# EAGLE design shield-rs422 (EAGLE 7.5.0)
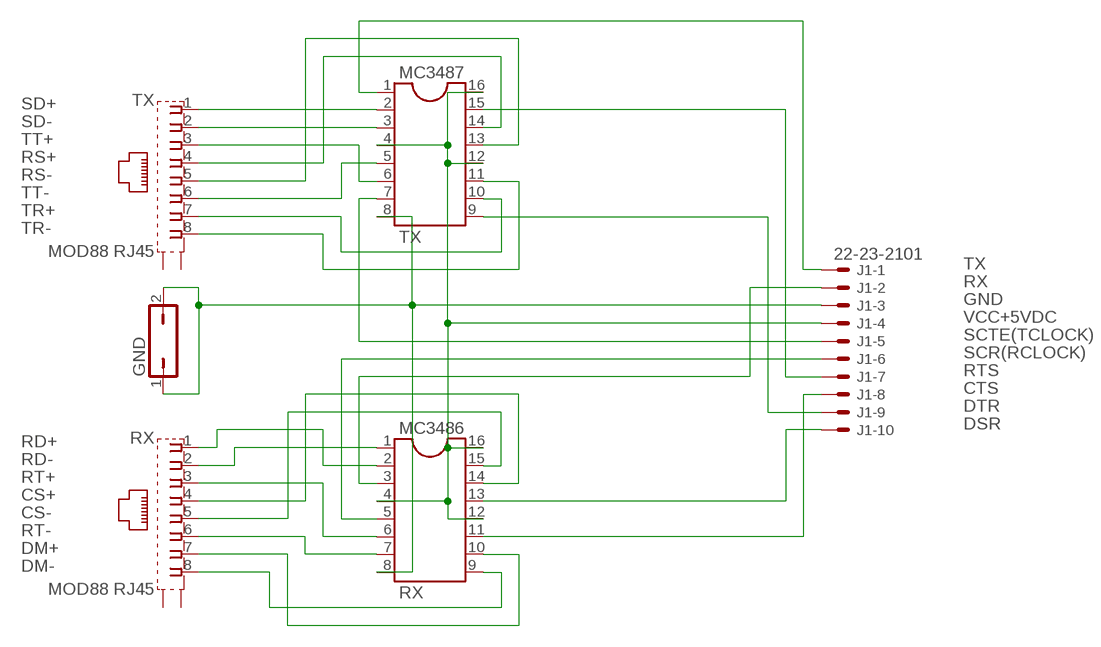
[diagram p0: schematic, sheet 1]

## Parts
GND  JP1Q  [JP1]
J1  22-23-2101  [22-23-2101]
MC3486  RX  DIL16  [DIL16]
MC3487  TX  DIL16  [DIL16]
RX  MOD88 RJ45  GLX-S-88M  [GLX-S-88M]
TX  MOD88 RJ45  GLX-S-88M  [GLX-S-88M]

## Nets
CS+: MC3486.14 RX.4
CS-: MC3486.15 RX.5
CTS: J1.8 MC3486.11
DM+: MC3486.10 RX.7
DM-: MC3486.9 RX.8
DSR: J1.10 MC3486.13
DTR: J1.9 MC3487.9
GND: GND.1 GND.2 J1.3 MC3486.8 MC3487.8
RD+: MC3486.2 RX.1
RD-: MC3486.1 RX.2
RS+: MC3487.14 TX.4
RS-: MC3487.13 TX.5
RT+: MC3486.6 RX.3
RT-: MC3486.7 RX.6
RTS: J1.7 MC3487.15
RX: J1.2 MC3486.3
SCR(RCLOCK): J1.6 MC3486.5
SCTE(TCLOCK): J1.5 MC3487.7
SD+: MC3487.2 TX.1
SD-: MC3487.3 TX.2
TR+: MC3487.10 TX.7
TR-: MC3487.11 TX.8
TT+: MC3487.6 TX.3
TT-: MC3487.5 TX.6
TX: J1.1 MC3487.1
VCC+5VDC: J1.4 MC3486.4 MC3486.12 MC3486.16 MC3487.4 MC3487.12 MC3487.16
Unconnected: RX.S1 RX.S2 TX.S1 TX.S2

## Library data of the parts
GND = jumper:JP1Q: JUMPER
J1 = con-molex:22-23-2101: .100" (2.54mm) Center Header - 10 Pin; MF: MOLEX; MPN: 22-23-2101; OC_FARNELL: 1756828; OC_NEWARK: 94C0765
MC3486 MC3487 = ic-package:DIL16: Dual In Line / Socket
RX TX = con-kycon:GLX-S-88M: Mod. Jack, Right Angle, 8 posiotion, 8 contatcs RJ45 Source: GLX-S-88M.pdf; OC_FARNELL: unknown; OC_NEWARK: unknown

## Board
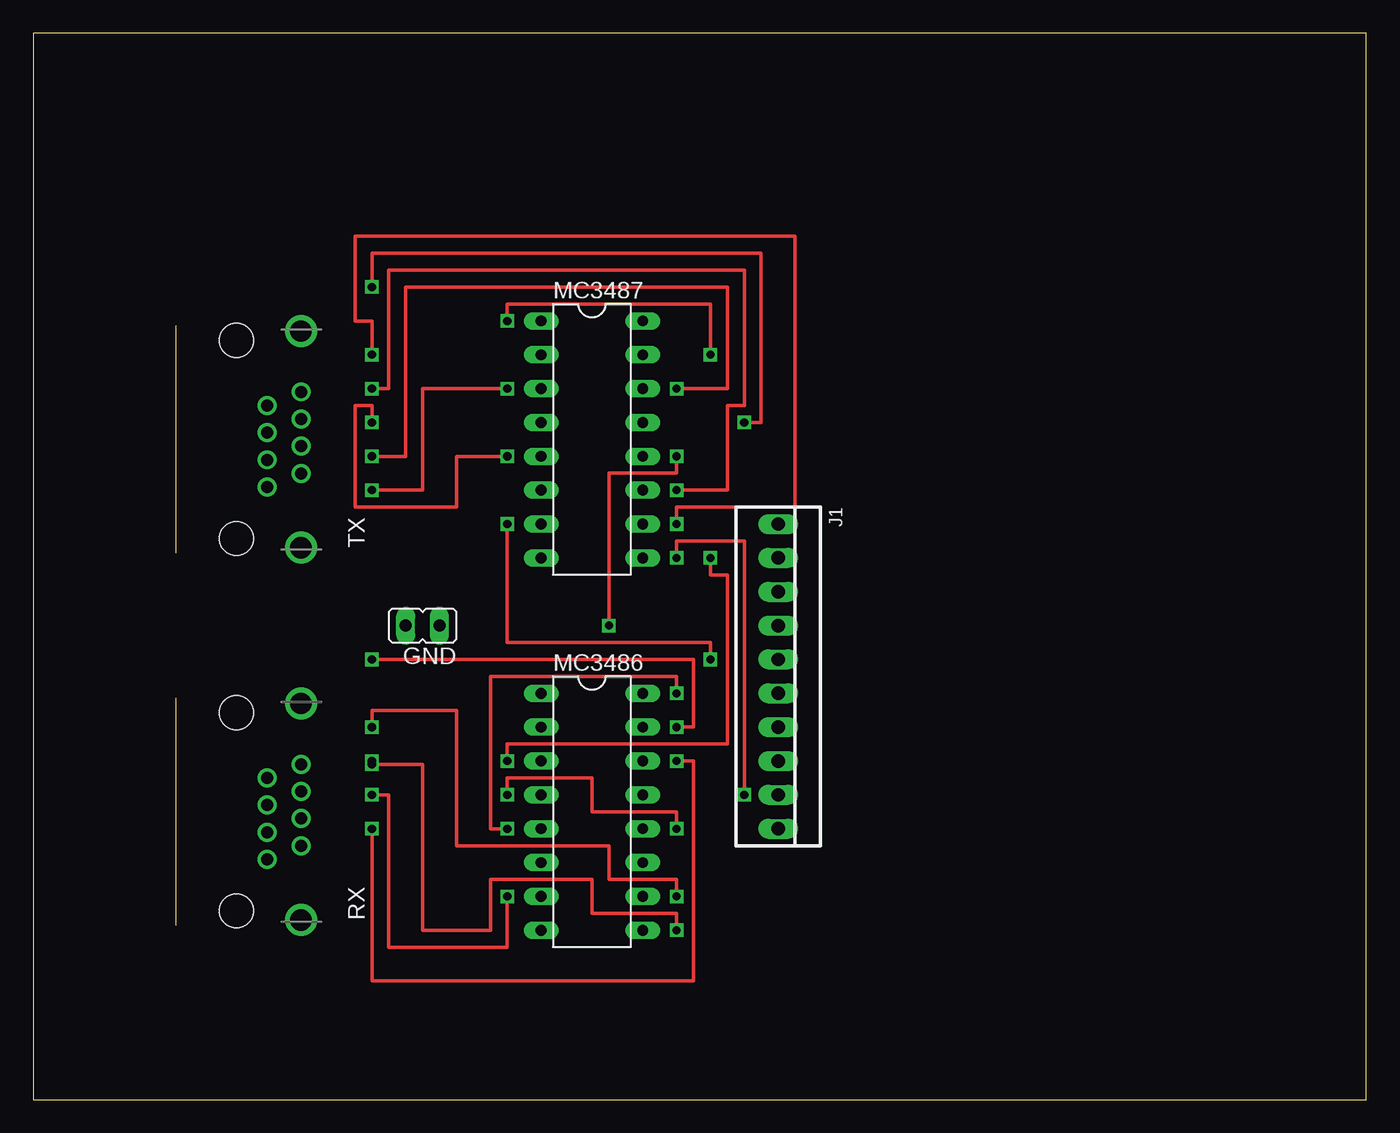
[diagram p1: board, top side]
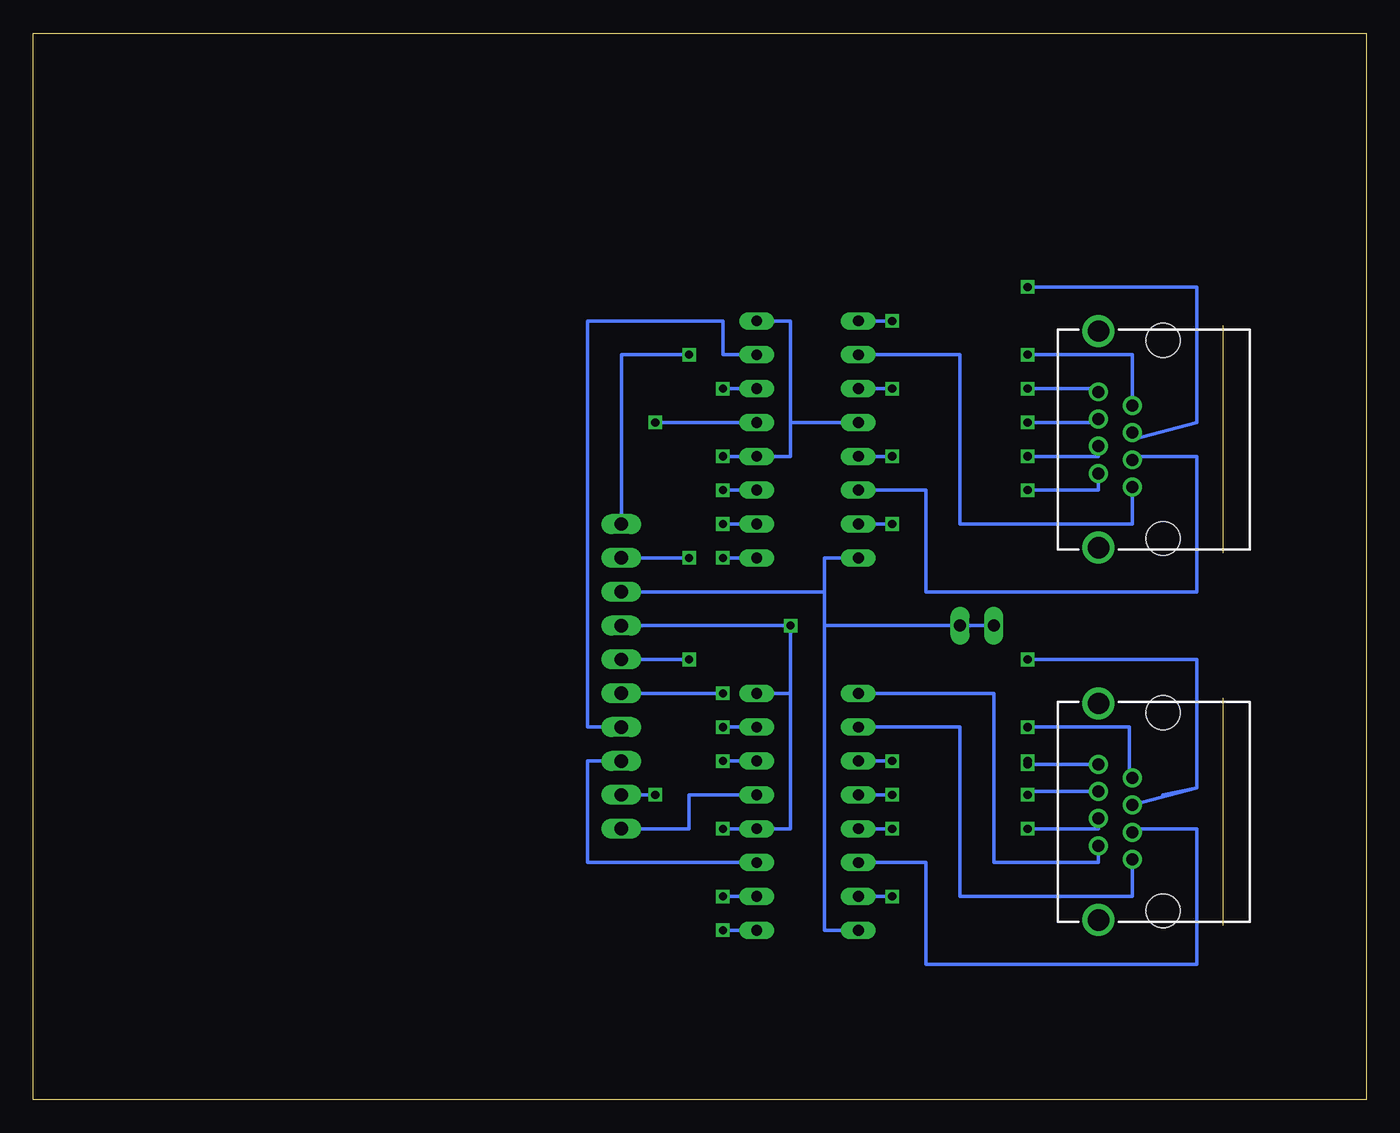
[diagram p2: board, bottom side, seen from below]

Size 100 x 80 mm. Coordinates in mm from the lower left corner, seen from the top.
Outline: 0,0 100,0 100,80 0,80 0,0
Copper layers (1*16): Top 0.035mm / dielectric 1.5mm / Bottom 0.035mm
Design rules "default": minimum track width 10mil, minimum drill 24mil, track to track 8mil, track to pad 8mil, pad to pad 8mil, via to via 8mil, smd to smd 8mil, copper to edge 40mil, drill to drill 8mil, minimum pad ring 10mil, minimum via ring 8mil, stop-mask expansion 4mil, vias tented up to drill 0mil, thermal gap 10mil

### Footprints (pad centres in the part's own frame; a part is rotated, then mirrored left to right if it is on the bottom)
JP1 = drill 0.914 long: 1 0,-1.27; 2 0,1.27
22-23-2101 = drill 1 long: 1 -11.43,0; 2 -8.89,0; 3 -6.35,0; 4 -3.81,0; 5 -1.27,0; 6 1.27,0; 7 3.81,0; 8 6.35,0; 9 8.89,0; 10 11.43,0
DIL16 = drill 0.813 long: 1 -8.89,-3.81; 2 -6.35,-3.81; 3 -3.81,-3.81; 4 -1.27,-3.81; 5 1.27,-3.81; 6 3.81,-3.81; 7 6.35,-3.81; 8 8.89,-3.81; 9 8.89,3.81; 10 6.35,3.81; 11 3.81,3.81; 12 1.27,3.81; 13 -1.27,3.81; 14 -3.81,3.81; 15 -6.35,3.81; 16 -8.89,3.81
GLX-S-88M = drill 0.9 pad 1.422: 1 -3.57,-2.3; 2 -2.55,-4.84; 3 -1.53,-2.3; 4 -0.51,-4.84; 5 0.51,-2.3; 6 1.53,-4.84; 7 2.55,-2.3; 8 3.57,-4.84 | drill 1.6 pad 2.184: S1 -8.125,-4.84; S2 8.125,-4.84 | hole 2.55: -7.44,0; 7.44,0

### Placement (x,y rotation side)
GND  29.21,35.56 90 top
J1  55.88,31.75 270 top
MC3486  41.91,21.59 270 top
MC3487  41.91,49.53 270 top
RX  15.24,21.59 90 top
TX  15.24,49.53 90 top

### Tracks (layer width: path | path; a pad name or v marks a point on that pad's centre or on a via)
CS+  (via drill 0.61)
  Top 0.254: v25.4,20.32 25.4,8.89 49.53,8.89 49.53,25.4 v48.26,25.4
  Bottom 0.254: MC3486.14 v48.26,25.4 | RX.4 20.08,20.32 v25.4,20.32
CS-  (via drill 0.61)
  Top 0.254: v48.26,27.94 49.53,27.94 49.53,33.02 v25.4,33.02
  Bottom 0.254: MC3486.15 v48.26,27.94 | RX.5 12.7,23.37 | 12.7,23.37 15.24,22.86 | v25.4,33.02 12.7,33.02 12.7,23.37
CTS
  Bottom 0.254: MC3486.11 58.42,17.78 58.42,25.4 J1.8
DM+  (via drill 0.61)
  Top 0.254: v48.26,15.24 48.26,16.51 43.18,16.51 43.18,19.05 31.75,19.05 31.75,29.21 25.4,29.21 v25.4,27.94
  Bottom 0.254: RX.7 17.78,24.14 17.78,27.94 v25.4,27.94 | MC3486.10 v48.26,15.24
DM-  (via drill 0.61)
  Top 0.254: v25.4,25.16 29.21,25.16 29.21,12.7 34.29,12.7 34.29,16.51 41.91,16.51 41.91,13.97 48.26,13.97 v48.26,12.7
  Bottom 0.254: RX.8 v25.4,25.16 v25.4,25.4 | MC3486.9 v48.26,12.7
DSR
  Bottom 0.254: MC3486.13 50.8,22.86 50.8,20.32 J1.10
DTR  (via drill 0.61)
  Top 0.254: v53.34,22.86 53.34,41.91 48.26,41.91 v48.26,40.64
  Bottom 0.254: MC3487.9 v48.26,40.64 | J1.9 v53.34,22.86
GND
  Bottom 0.254: 40.64,38.1 40.64,40.64 MC3487.8 | 40.64,35.56 40.64,12.7 MC3486.8 | 40.64,38.1 J1.3 | GND.2 GND.1 40.64,35.56 | 40.64,38.1 40.64,35.56
RD+
  Bottom 0.254: MC3486.2 30.48,27.94 30.48,15.24 17.54,15.24 RX.1
RD-
  Bottom 0.254: MC3486.1 27.94,30.48 27.94,17.78 20.08,17.78 RX.2
RS+  (via drill 0.61)
  Top 0.254: v25.4,48.26 27.94,48.26 27.94,60.96 52.07,60.96 52.07,53.34 v48.26,53.34
  Bottom 0.254: MC3487.14 v48.26,53.34 | TX.4 20.08,48.26 v25.4,48.26
RS-  (via drill 0.61)
  Top 0.254: v25.4,60.96 25.4,63.5 54.61,63.5 54.61,50.8 v53.34,50.8
  Bottom 0.254: MC3487.13 v53.34,50.8 | TX.5 17.54,49.53 12.7,50.8 12.7,60.96 v25.4,60.96
RT+
  Bottom 0.254: MC3486.6 33.02,17.78 33.02,10.16 12.7,10.16 12.7,20.32 17.54,20.32 RX.3
RT-  (via drill 0.61)
  Top 0.254: v25.4,22.86 26.67,22.86 26.67,11.43 35.56,11.43 v35.56,15.24
  Bottom 0.254: RX.6 25.4,23.12 v25.4,22.86 | MC3486.7 v35.56,15.24
RTS
  Bottom 0.254: J1.7 58.42,27.94 58.42,58.42 48.26,58.42 48.26,55.88 MC3487.15
RX  (via drill 0.61)
  Top 0.254: v50.8,40.64 50.8,39.37 52.07,39.37 52.07,26.67 35.56,26.67 v35.56,25.4
  Bottom 0.254: J1.2 v50.8,40.64 | MC3486.3 v35.56,25.4
SCR(RCLOCK)  (via drill 0.61)
  Top 0.254: v35.56,20.32 34.29,20.32 34.29,31.75 48.26,31.75 v48.26,30.48
  Bottom 0.254: J1.6 v48.26,30.48 | MC3486.5 v35.56,20.32
SCTE(TCLOCK)  (via drill 0.61)
  Top 0.254: v35.56,43.18 35.56,34.29 50.8,34.29 v50.8,33.02
  Bottom 0.254: MC3487.7 v35.56,43.18 | J1.5 v50.8,33.02
SD+
  Bottom 0.254: TX.1 17.54,43.18 30.48,43.18 30.48,55.88 MC3487.2
SD-  (via drill 0.61)
  Top 0.254: v25.4,45.72 29.21,45.72 29.21,53.34 v35.56,53.34
  Bottom 0.254: MC3487.3 v35.56,53.34 | TX.2 20.08,45.72 v25.4,45.72
TR+  (via drill 0.61)
  Top 0.254: v25.4,55.88 25.4,58.42 24.13,58.42 24.13,64.77 57.15,64.77 57.15,44.45 48.26,44.45 v48.26,43.18
  Bottom 0.254: MC3487.10 v48.26,43.18 | TX.7 17.54,55.88 v25.4,55.88
TR-  (via drill 0.61)
  Top 0.254: v25.4,53.34 26.67,53.34 26.67,62.23 53.34,62.23 53.34,52.07 52.07,52.07 52.07,45.72 v48.26,45.72
  Bottom 0.254: MC3487.11 v48.26,45.72 | TX.8 20.08,53.34 v25.4,53.34
TT+
  Bottom 0.254: TX.3 17.54,48.26 12.7,48.26 12.7,38.1 33.02,38.1 33.02,45.72 MC3487.6
TT-  (via drill 0.61)
  Top 0.254: v35.56,48.26 31.75,48.26 31.75,44.45 24.13,44.45 24.13,52.07 25.4,52.07 v25.4,50.8
  Bottom 0.254: MC3487.5 v35.56,48.26 | TX.6 20.08,50.8 v25.4,50.8
TX  (via drill 0.61)
  Top 0.254: v50.8,55.88 50.8,59.69 35.56,59.69 v35.56,58.42
  Bottom 0.254: J1.1 55.88,55.88 v50.8,55.88 | MC3487.1 v35.56,58.42
VCC+5VDC  (via drill 0.61)
  Top 0.254: v35.56,22.86 35.56,24.13 41.91,24.13 41.91,21.59 48.26,21.59 v48.26,20.32 | v43.18,35.56 43.18,46.99 48.26,46.99 v48.26,48.26
  Bottom 0.254: 43.18,50.8 43.18,48.26 MC3487.12 v48.26,48.26 | 43.18,50.8 43.18,58.42 MC3487.16 | J1.4 v43.18,35.56 43.18,30.48 | 43.18,30.48 MC3486.16 | 43.18,30.48 43.18,20.32 MC3486.12 v48.26,20.32 | MC3486.4 v35.56,22.86 | MC3487.4 43.18,50.8